# EAGLE design cpx-module1-B (EAGLE 8.7.0)
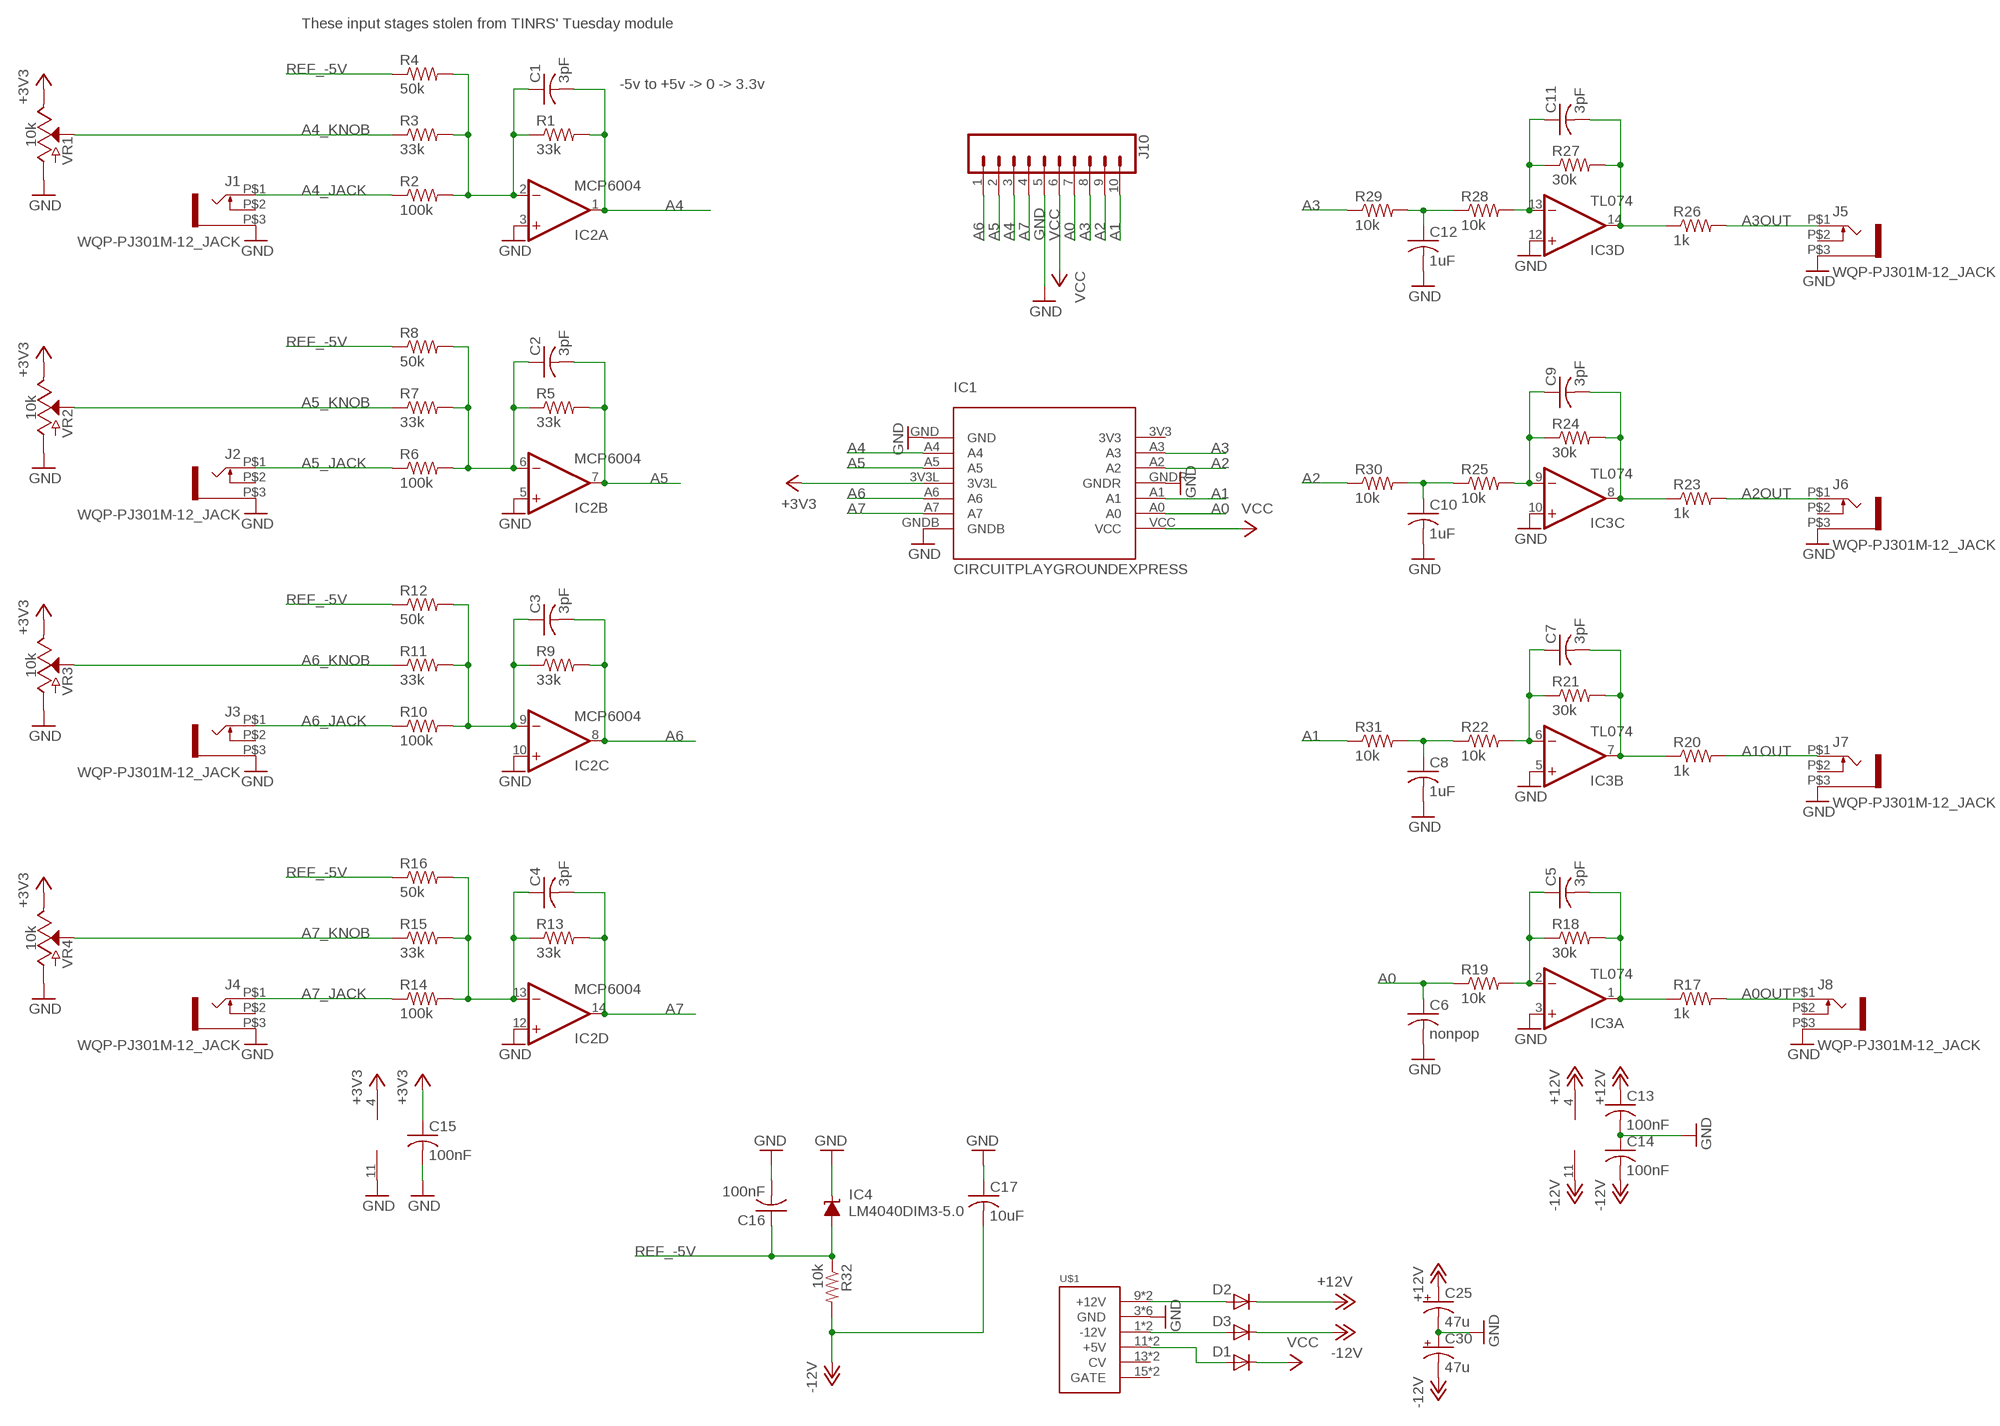
[diagram p0: schematic, sheet 1]

## Parts
C1  3pF  C-USC0603  [C0603]
C2  3pF  C-USC0603  [C0603]
C3  3pF  C-USC0603  [C0603]
C4  3pF  C-USC0603  [C0603]
C5  3pF  C-USC0603  [C0603]
C6  nonpop  C-USC0603  [C0603]
C7  3pF  C-USC0603  [C0603]
C8  1uF  C-USC0603  [C0603]
C9  3pF  C-USC0603  [C0603]
C10  1uF  C-USC0603  [C0603]
C11  3pF  C-USC0603  [C0603]
C12  1uF  C-USC0603  [C0603]
C13  100nF  C-USC0603  [C0603]
C14  100nF  C-USC0603  [C0603]
C15  100nF  C-USC0603  [C0603]
C16  100nF  C-USC0603  [C0603]
C17  10uF  C-USC0603  [C0603]
C25  47u  CPOL-USD  [PANASONIC_D]
C30  47u  CPOL-USD  [PANASONIC_D]
D1  1N5819HW  DIODE-SOD123  [SOD123]
D2  1N5819HW  DIODE-SOD123  [SOD123]
D3  1N5819HW  DIODE-SOD123  [SOD123]
IC1  CIRCUITPLAYGROUNDEXPRESS  [CIRCUITPLAYGROUNDEXPRESS]
IC2  MCP6004  TL074D  [SO14]
IC3  TL074  TL074D  [SO14]
IC4  LM4040DIM3-5.0  LM4041B12DBZ  [DBZ_R-PDSO-G3]
J1  WQP-PJ301M-12_JACK  [WQP-PJ301M-12_JACK]
J2  WQP-PJ301M-12_JACK  [WQP-PJ301M-12_JACK]
J3  WQP-PJ301M-12_JACK  [WQP-PJ301M-12_JACK]
J4  WQP-PJ301M-12_JACK  [WQP-PJ301M-12_JACK]
J5  WQP-PJ301M-12_JACK  [WQP-PJ301M-12_JACK]
J6  WQP-PJ301M-12_JACK  [WQP-PJ301M-12_JACK]
J7  WQP-PJ301M-12_JACK  [WQP-PJ301M-12_JACK]
J8  WQP-PJ301M-12_JACK  [WQP-PJ301M-12_JACK]
J10  CONN_10"  [1X10]
R1  33k  R-US_R0603  [R0603]
R2  100k  R-US_R0603  [R0603]
R3  33k  R-US_R0603  [R0603]
R4  50k  R-US_R0603  [R0603]
R5  33k  R-US_R0603  [R0603]
R6  100k  R-US_R0603  [R0603]
R7  33k  R-US_R0603  [R0603]
R8  50k  R-US_R0603  [R0603]
R9  33k  R-US_R0603  [R0603]
R10  100k  R-US_R0603  [R0603]
R11  33k  R-US_R0603  [R0603]
R12  50k  R-US_R0603  [R0603]
R13  33k  R-US_R0603  [R0603]
R14  100k  R-US_R0603  [R0603]
R15  33k  R-US_R0603  [R0603]
R16  50k  R-US_R0603  [R0603]
R17  1k  R-US_R0603  [R0603]
R18  30k  R-US_R0603  [R0603]
R19  10k  R-US_R0603  [R0603]
R20  1k  R-US_R0603  [R0603]
R21  30k  R-US_R0603  [R0603]
R22  10k  R-US_R0603  [R0603]
R23  1k  R-US_R0603  [R0603]
R24  30k  R-US_R0603  [R0603]
R25  10k  R-US_R0603  [R0603]
R26  1k  R-US_R0603  [R0603]
R27  30k  R-US_R0603  [R0603]
R28  10k  R-US_R0603  [R0603]
R29  10k  R-US_R0603  [R0603]
R30  10k  R-US_R0603  [R0603]
R31  10k  R-US_R0603  [R0603]
R32  10k  R-US_R0603  [R0603]
U$1  POWER  [POWER_16]
VR1  10k  POTENTIOMETER-PTH-9MM-1/20W-20%-KIT  [POT-PTH-ALPS-KIT]
VR2  10k  POTENTIOMETER-PTH-9MM-1/20W-20%-KIT  [POT-PTH-ALPS-KIT]
VR3  10k  POTENTIOMETER-PTH-9MM-1/20W-20%-KIT  [POT-PTH-ALPS-KIT]
VR4  10k  POTENTIOMETER-PTH-9MM-1/20W-20%-KIT  [POT-PTH-ALPS-KIT]

## Nets
+3V3: C15.1 IC1.3V3L IC2.4(P:V+) VR1.P$1(E) VR2.P$1(E) VR3.P$1(E) VR4.P$1(E)
+12V: C13.1 C25.+ D2.C IC3.4(P:V+)
-12V: C14.2 C17.2 C30.- D3.C IC3.11(P:V-) R32.2
A0: C6.1 IC1.A0 J10.7 R19.1
A0OUT: J8.P$1 R17.2
A1: IC1.A1 J10.10 R31.1
A1OUT: J7.P$1 R20.2
A2: IC1.A2 J10.9 R30.1
A2OUT: J6.P$1 R23.2
A3: IC1.A3 J10.8 R29.1
A3OUT: J5.P$1 R26.2
A4: C1.2 IC1.A4 IC2.1(A:OUT) J10.3 R1.2
A4_JACK: J1.P$1 R2.1
A4_KNOB: R3.1 VR1.P$2(S)
A5: C2.2 IC1.A5 IC2.7(B:OUT) J10.2 R5.2
A5_JACK: J2.P$1 R6.1
A5_KNOB: R7.1 VR2.P$2(S)
A6: C3.2 IC1.A6 IC2.8(C:OUT) J10.1 R9.2
A6_JACK: J3.P$1 R10.1
A6_KNOB: R11.1 VR3.P$2(S)
A7: C4.2 IC1.A7 IC2.14(D:OUT) J10.4 R13.2
A7_JACK: J4.P$1 R14.1
A7_KNOB: R15.1 VR4.P$2(S)
GND: C6.2 C8.2 C10.2 C12.2 C13.2 C14.1 C15.2 C16.2 C17.1 C25.- C30.+ IC1.GND IC1.GNDB IC1.GNDR IC2.3(A:+IN) IC2.5(B:+IN) IC2.10(C:+IN) IC2.11(P:V-) IC2.12(D:+IN) IC3.3(A:+IN) IC3.5(B:+IN) IC3.10(C:+IN) IC3.12(D:+IN) IC4.1(C) J1.P$3 J2.P$3 J3.P$3 J4.P$3 J5.P$3 J6.P$3 J7.P$3 J8.P$3 J10.5 U$1.3(GND) U$1.4(GND) U$1.5(GND) U$1.6(GND) U$1.7(GND) U$1.8(GND) VR1.P$3(A) VR2.P$3(A) VR3.P$3(A) VR4.P$3(A)
N$1: C5.2 IC3.1(A:OUT) R17.1 R18.2
N$2: C2.1 IC2.6(B:-IN) R5.1 R6.2 R7.2 R8.2
N$3: C3.1 IC2.9(C:-IN) R9.1 R10.2 R11.2 R12.2
N$4: C4.1 IC2.13(D:-IN) R13.1 R14.2 R15.2 R16.2
N$5: C1.1 IC2.2(A:-IN) R1.1 R2.2 R3.2 R4.2
N$7: C5.1 IC3.2(A:-IN) R18.1 R19.2
N$8: C7.2 IC3.7(B:OUT) R20.1 R21.2
N$9: C7.1 IC3.6(B:-IN) R21.1 R22.2
N$10: C9.2 IC3.8(C:OUT) R23.1 R24.2
N$12: C9.1 IC3.9(C:-IN) R24.1 R25.2
N$14: C11.2 IC3.14(D:OUT) R26.1 R27.2
N$15: C11.1 IC3.13(D:-IN) R27.1 R28.2
N$17: D2.A U$1.9(+12V) U$1.10(+12V)
N$18: D3.A U$1.1(-12V) U$1.2(-12V)
N$19: D1.A U$1.11(+5V) U$1.12(+5V)
N$20: C12.1 R28.1 R29.2
N$21: C10.1 R25.1 R30.2
N$22: C8.1 R22.1 R31.2
REF_-5V: C16.1 IC4.2(A) R4.1 R8.1 R12.1 R16.1 R32.1
VCC: D1.C IC1.VCC J10.6
Unconnected: IC1.3V3 J1.P$2 J2.P$2 J3.P$2 J4.P$2 J5.P$2 J6.P$2 J7.P$2 J8.P$2 U$1.13(CV) U$1.14(CV) U$1.15(GATE) U$1.16(GATE)

## Notes on the sheet
- These input stages stolen from TINRS' Tuesday module
- -5v to +5v -> 0 -> 3.3v

## Library data of the parts
C1-C17 = rcl:C-US: CAPACITOR, American symbol; SPICEPREFIX: C
C25 C30 = rcl:CPOL-US: POLARIZED CAPACITOR, American symbol
D1-D3 = diode:DIODE-: DIODE
IC1 = todstuff:CIRCUITPLAYGROUNDEXPRESS
IC2 IC3 = gm-ics:TL074: OP AMP
IC4 = texas:LM4041: PRECISION MICROPOWER SHUNT VOLTAGE REFERENCE Source: http://focus.ti.com/lit/ds/slcs146e/slcs146e.pdf; MPN: LM4041B12IDBZR; OC_FARNELL: 1575212; OC_NEWARK: 58K5882
J1-J8 = thonkiconn:WQP-PJ301M-12_JACK
J10 = SparkFun-Connectors:CONN_10: Multi connection point. Often used as Generic Header-pin footprint for 0.1 inch spaced/style header connections On any of the 0.1 inch spaced packages, you can populate with these: Break Away Headers - Straight <https://www.sparkfun.com/products/116> (PRT-00116) Break Away Male Headers - Right Angle <https://www.sparkfun.com/products/553> (PRT-00553) Female Headers <https://www.sparkfun.com/products/115> (PRT-00115) Break Away Headers - Machine Pin <https://www.sparkfun.com/products/117> (PRT-00117) Break Away Female Headers - Swiss Machine Pin <https://www.sparkfun.com/products/743> (PRT-00743) Arduino Stackable Header - 10 Pin <https://www.sparkfun.com/products/11376> (PRT-11376) For SCREWTERMINALS and SPRING TERMINALS visit here: Screw Terimnals on SparkFun.com <https://www.sparkfun.com/search/results?term=Screw+Terminals> (5mm/3.5mm/2.54mm spacing) This device is also useful as a general connection point to wire up your design to another part of your project. Our various solder wires solder well into these plated through hole pads. Hook-Up Wire - Assortment (Stranded, 22 AWG) <https://www.sparkfun.com/products/11375> (PRT-11375) Hook-Up Wire - Assortment (Solid Core, 22 AWG) <https://www.sparkfun.com/products/11367> (PRT-11367) View the entire wire category on our website here <https://www.sparkfun.com/categories/141> Special notes: Molex polarized connector foot print use with SKU : PRT-08231 with associated crimp pins and housings. 1MM SMD Version SKU: PRT-10208 NOTES ON THE VARIANTS LOCK and LOCK_LONGPADS... This footprint was designed to help hold the alignment of a through-hole component (i.e. 6-pin header) while soldering it into place. You may notice that each hole has been shifted either up or down by 0.005 of an inch from it's more standard position (which is a perfectly straight line). This slight alteration caused the pins (the squares in the middle) to touch the edges of the holes. Because they are alternating, it causes a "brace" to hold the component in place. 0.005 has proven to be the perfect amount of "off-center" position when using our standard breakaway headers. Although looks a little odd when you look at the bare footprint, once you have a header in there, the alteration is very hard to notice. Also,if you push a header all the way into place, it is covered up entirely on the bottom side.; PROD_ID: CONN-11563
R1-R32 = adafruit:R-US_: RESISTOR, American symbol
U$1 = eurorack:POWER
VR1-VR4 = SparkFun-Resistors:POTENTIOMETER: Potentiometer (Pot) Three-terminal potentiometers, with an adjustable wiper and two adjustable resistors. A pot can be used to create a configurable voltage divider, or as a variable resistor. Variants ALPS_POT and ALPS_POT_KIT - PTH, breadboard compatible, 9mm square pots Rotary Potentiometer - Linear (10k ohm) <https://www.sparkfun.com/products/9288> (COM-09288) The KIT variant exposes copper on only one side of the PTH pad, so the part can only be assembled on one side of the PCB. Useful for beginner soldering kits.; PROD_ID: RES-09177; SF_SKU: COM-09288

## Net classes
1 heavypower: width 0.381 mm
2 mediumpower: width 0.254 mm
3 groundplane: width 0.254 mm, clearance 0.203 mm

## Board
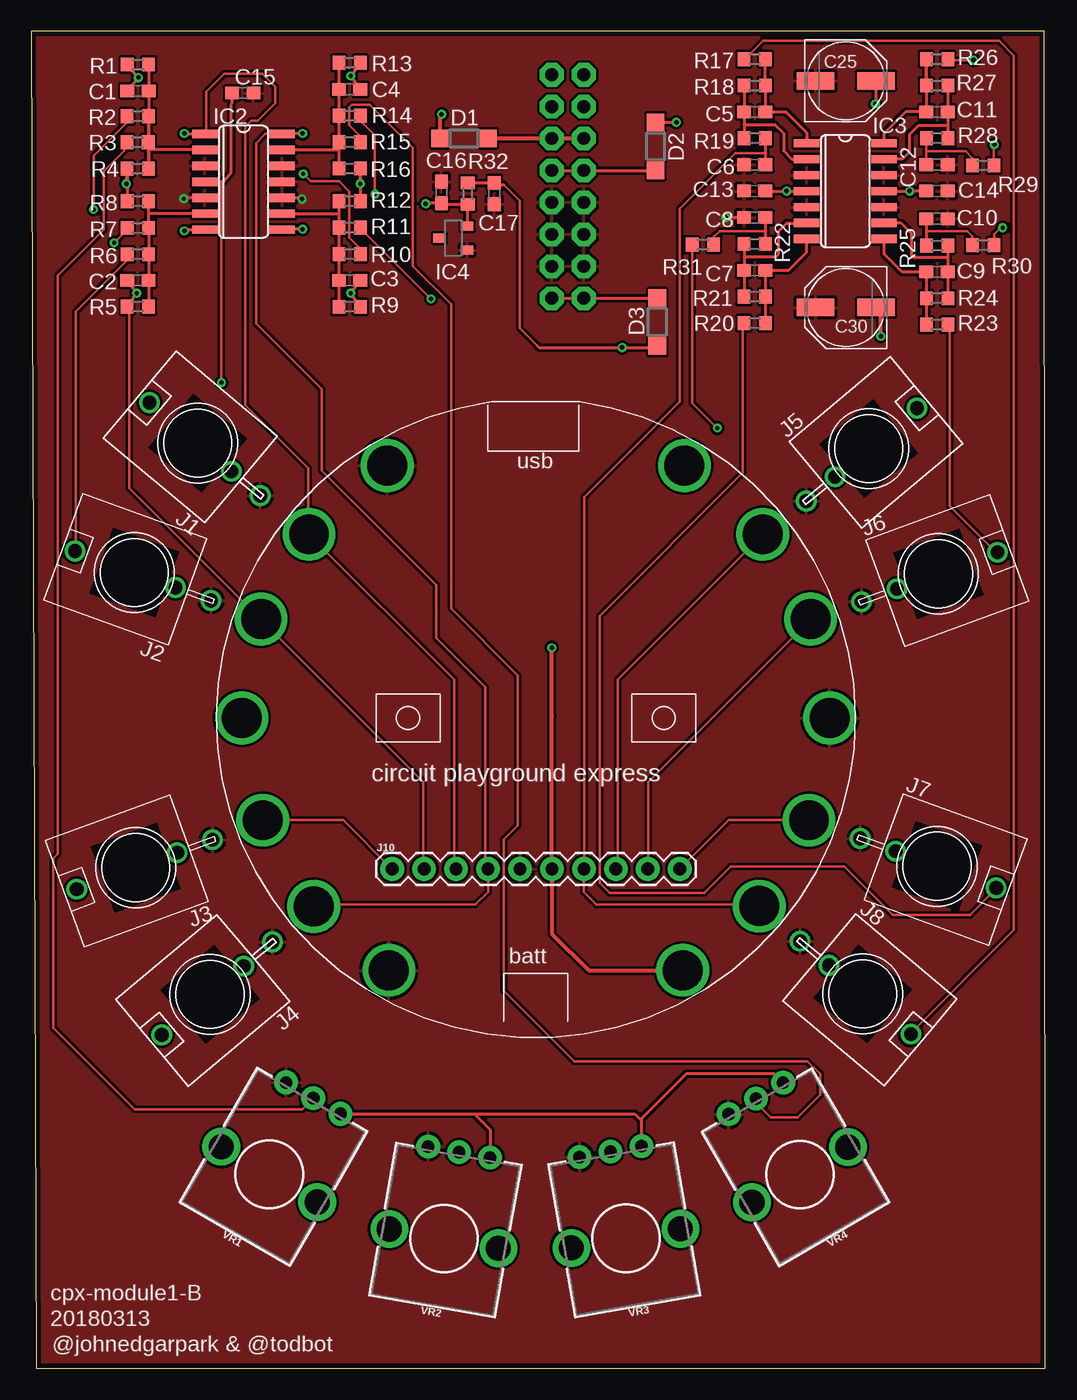
[diagram p1: board, top side]
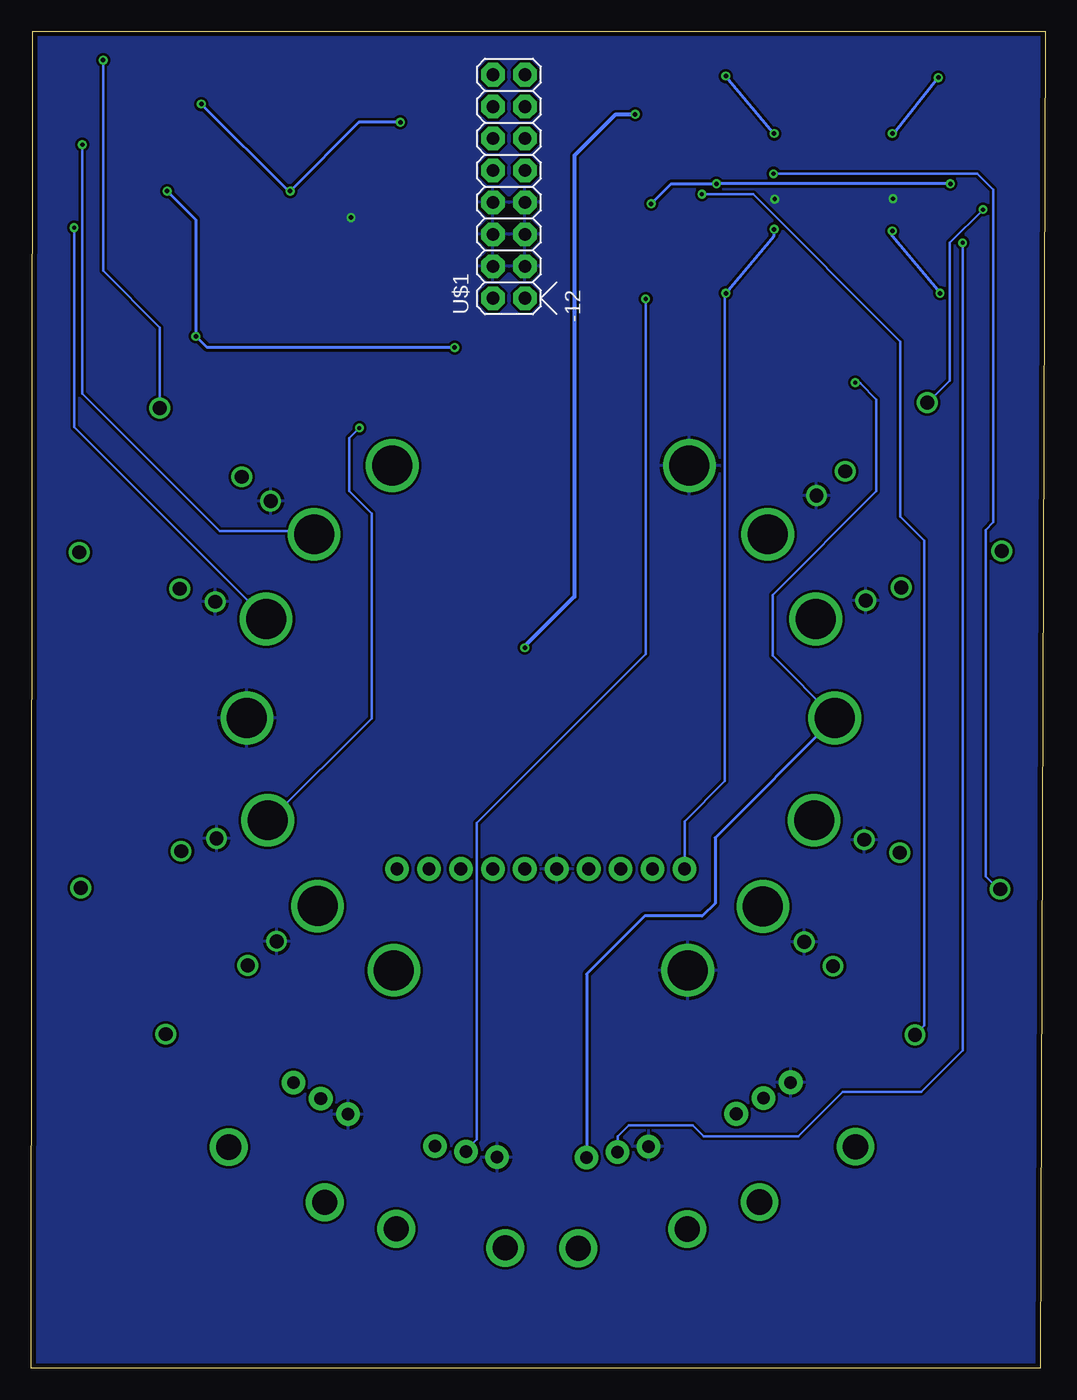
[diagram p2: board, bottom side, seen from below]

Size 80.6 x 106.3 mm. Coordinates in mm from the lower left corner, seen from the top.
Outline: 0.4,0 80.6,0 80.5,106.3 0,106.3 0.4,0
Copper layers (1*16): Top 0.0356mm / dielectric 1.5011mm / Bottom 0.0356mm
Design rules "LaenPCBOrderTodTent8mil": minimum track width 8mil, minimum drill 13mil, track to track 8mil, track to pad 8mil, pad to pad 8mil, via to via 8mil, smd to smd 8mil, copper to edge 15mil, drill to drill 8mil, minimum pad ring 7mil, minimum via ring 7mil, stop-mask expansion 3mil, vias tented up to drill 20mil, thermal gap 10mil

### Footprints (pad centres in the part's own frame; a part is rotated, then mirrored left to right if it is on the bottom)
C0603 = smd 1.1 x 1: 1 -0.85,0; 2 0.85,0
PANASONIC_D = smd 3 x 1.4: + 2.4,0; - -2.4,0
SOD123 = smd 1.4 x 1.4: A 1.9,0; C -1.9,0
CIRCUITPLAYGROUNDEXPRESS = drill 3.175: 3V3 11.811,20.066; 3V3L -23.368,0; A0 17.755,-14.961; A1 21.717,-8.128; A2 21.844,7.874; A3 18.034,14.605; A4 -18.034,14.605; A5 -21.844,7.874; A6 -21.717,-8.128; A7 -17.653,-14.986; GND -11.811,20.066; GNDB -11.684,-20.066; GNDR 23.368,0; VCC 11.684,-20.066
SO14 = smd 0.66 x 2.032: 1 -3.81,-3.073; 2 -2.54,-3.073; 3 -1.27,-3.073; 4 0,-3.073; 5 1.27,-3.073; 6 2.54,-3.073; 7 3.81,-3.073; 8 3.81,3.073; 9 2.54,3.073; 10 1.27,3.073; 11 0,3.073; 12 -1.27,3.073; 13 -2.54,3.073; 14 -3.81,3.073
DBZ_R-PDSO-G3 = smd 0.7 x 1: 1 -0.95,-1.1; 2 0.95,-1.1; 3 0,1.1
WQP-PJ301M-12_JACK = drill 1.1: P$1 0,5; P$2 0,-3.5; P$3 0,-6.5
1X10 = drill 1.016 pad 1.88: 1 0,0; 2 2.54,0; 3 5.08,0; 4 7.62,0; 5 10.16,0; 6 12.7,0; 7 15.24,0; 8 17.78,0; 9 20.32,0; 10 22.86,0
R0603 = smd 1 x 1.1: 1 -0.85,0; 2 0.85,0
POWER_16 = drill 1.016 pad 1.88 octagon: 1 -6.35,-1.27; 2 -6.35,1.27; 3 -3.81,-1.27; 4 -3.81,1.27; 5 -1.27,-1.27; 6 -1.27,1.27; 7 1.27,-1.27; 8 1.27,1.27; 9 3.81,-1.27; 10 3.81,1.27; 11 6.35,-1.27; 12 6.35,1.27; 13 8.89,-1.27; 14 8.89,1.27; 15 11.43,-1.27; 16 11.43,1.27
POT-PTH-ALPS-KIT = drill 1 pad 1.88: P$1 7,-2.5; P$2 7,0; P$3 7,2.5 | drill 2: P$4 0,-4.4; P$5 0,4.4

### Placement (x,y rotation side)
C1  8.46,101.57 180 top
C2  8.46,86.51 180 top
C3  25.3,86.5 0 top
C4  25.3,101.7 0 top
C5  57.5,99.9 0 top
C6  57.5,95.7 180 top
C7  57.5,87.3 0 top
C8  57.5,91.5 180 top
C9  72,87.17 180 top
C10  72,91.4 0 top
C11  72,99.9 180 top
C12  72,95.7 0 top
C13  57.5,93.6 180 top
C14  72,93.6 180 top
C15  16.8,101.4 0 top
C16  32.59,93.5 90 top
C17  36.8,93.4 90 top
C25  64.74,102.37 0 top
C30  64.74,84.34 180 top
D1  34.39,97.8 0 top
D2  49.62,97.17 270 top
D3  49.75,83.2 90 top
IC1  40.1,51.7 0 top
IC2  16.86,94.34 270 top
IC3  64.7,93.6 270 top
IC4  33.54,89.85 90 top
J1  13.21,73.57 50 top
J2  8.17,63.27 70 top
J3  8.29,39.79 110 top
J4  14.19,29.72 130 top
J5  66.57,73.12 310 top
J6  72.1,63.17 290 top
J7  71.99,39.9 250 top
J8  66.09,29.77 230 top
J10  28.68,39.69 0 top
R1  8.46,103.67 180 top
R2  8.46,99.55 0 top
R3  8.44,97.48 0 top
R4  8.46,95.38 0 top
R5  8.46,84.42 180 top
R6  8.46,88.57 0 top
R7  8.46,90.67 0 top
R8  8.46,92.8 0 top
R9  25.3,84.4 0 top
R10  25.3,88.6 180 top
R11  25.3,90.7 180 top
R12  25.3,92.8 180 top
R13  25.3,103.8 0 top
R14  25.3,99.6 180 top
R15  25.3,97.5 180 top
R16  25.3,95.4 180 top
R17  57.5,104.1 180 top
R18  57.5,102 0 top
R19  57.5,97.8 180 top
R20  57.5,83.1 180 top
R21  57.5,85.2 0 top
R22  57.5,89.4 180 top
R23  72,82.97 0 top
R24  72,85.07 180 top
R25  72,89.27 0 top
R26  72,104.1 0 top
R27  72,102 180 top
R28  72,97.8 0 top
R29  75.66,95.64 180 top
R30  75.66,89.29 180 top
R31  53.38,89.35 0 top
R32  34.7,93.4 90 top
U$1  42.64,91.43 90 bottom
VR1  18.9,15.4 60 top
VR2  32.79,10.29 80 top
VR3  47.26,10.32 100 top
VR4  61.1,15.38 120 top

### Tracks (layer width: path | path; a pad name or v marks a point on that pad's centre or on a via)
+3V3  (via drill 0.33)
  Top 0.203: 36.65,16.75 VR2.P$1 36.44,16.75 | 48.43,17.77 VR3.P$1 48.63,17.77 | v15.11,78.37 15.11,94.34 15.11,94.37
  Top 0.254: IC2.4 15.11,94.34 15.25,94.34 15.33,94.42 15.88,95.1 15.88,100.46 15.95,100.65 C15.1 | VR4.P$1 59.07,23.38 52.04,23.38 48.48,19.82 48.48,19.7 | 48.48,19.7 48.48,17.82 48.43,17.77 | VR2.P$1 36.49,18.93 35.21,20.22 | VR1.P$1 35.21,20.22 | 35.21,20.22 47.96,20.22 48.48,19.7
  Bottom 0.203: v15.11,78.37 14.73,78.32 13.43,77.02 13.43,69.73 21.69,61.48 21.69,56.65 IC1.3V3L
  Bottom 0.254: IC1.3V3L 26.26,42.18 26.26,36.97 27.27,35.95 31.84,35.95 36.47,31.33 VR2.P$1
+12V  (via drill 0.35)
  Top 0.254: C25.+ 67.14,100.58 v67.09,100.53 | C13.1 v60.04,93.6 IC3.4 | D2.C v51.27,99.07 v51.28,99.07
  Bottom 0.254: v67.09,100.53 60.16,93.6 v60.04,93.6 54.57,99.07 v51.28,99.07
-12V  (via drill 0.35)
  Top 0.203: 40.22,81.3 38.83,82.69 38.83,92.83 37.56,94.1
  Top 0.254: R32.2 C17.2 36.95,94.1 37.56,94.1 | IC3.11 v69.82,93.6 C14.2 | 40.22,81.3 40.35,81.16 v46.96,81.16 49.62,81.16 D3.C
  Top 0.305: v67.53,82.05 67.53,84.34 | 67.66,84.47 67.53,84.34 | 67.53,84.34 C30.-
  Bottom 0.254: v46.96,81.16 66.64,81.16 v67.53,82.05 67.53,91.31 v69.82,93.6
A0
  Top 0.203: 58.39,96.61 58.35,96.61 55.95,96.61 51.53,92.19 51.53,76.85 47.62,72.93 47.62,72.91 43.96,69.25 43.96,39.71 J10.7 | IC1.A0 57.78,36.87 44.95,36.87 44.93,36.84 43.92,37.85 J10.7 | 43.96,39.51 J10.7
  Top 0.254: R19.1 58.35,96.61 C6.1
A0OUT
  Top 0.203: R17.2 56.76,104.13 58.19,105.55 76.93,105.55 78.1,104.38 78.1,34.83 69.97,26.71 J8.P$1
A1  (via drill 0.33)
  Top 0.203: v54.53,74.76 52.53,76.76 R31.1 | IC1.A1 55.42,43.57 J10.10
  Bottom 0.203: IC1.A1 61.64,43.57 53.56,51.65 53.56,67.96 55.34,69.73 55.34,73.95 v54.53,74.76 | 51.68,39.71 J10.10
A1OUT
  Top 0.203: R20.2 56.56,82.99 56.56,71.21 45.18,59.83 45.18,38.59 45.99,37.78 53.49,37.78 55.59,39.89 64.64,39.89 68.47,36.05 74.64,36.05 76.68,38.09 J7.P$1
A2  (via drill 0.33)
  Top 0.203: J10.9 49.04,39.71 49.04,46.62 61.84,59.42 IC1.A2 | R30.1 76.55,89.33 76.55,90.18 77.06,90.69 v77.21,90.69
  Bottom 0.203: 62.05,59.62 IC1.A2 77.21,74.84 v77.21,90.69
A2OUT
  Top 0.203: R23.2 73.02,82.79 73.02,68.57 76.68,64.91 J6.P$1
A3  (via drill 0.35)
  Top 0.203: 58.19,66.33 IC1.A3 57.98,66.13 46.6,54.75 46.6,39.71 J10.8 | R29.1 76.51,97.25 v76.55,97.29
  Bottom 0.203: v76.55,97.29 76.55,77.48 65.63,66.56 58.39,66.56 IC1.A3
A3OUT  (via drill 0.35)
  Top 0.203: 73.02,103.92 R26.2 72.93,104.02 v74.9,104.02 | 70.58,76.49 J5.P$1
  Bottom 0.203: v74.9,104.02 74.9,87.26 70.4,82.76 J5.P$1
A4  (via drill 0.35)
  Top 0.203: J10.3 33.6,39.71 33.6,54.75 22.22,66.13 IC1.A4 22.02,66.33 22.02,71.56 17.01,76.57 17.01,98.72 17.49,99.2 18,99.2 19.4,100.59 19.4,101.89 18.36,102.93 15.31,102.93 13.89,101.51 13.89,98.23 IC2.1
  Top 0.254: R1.2 v8.5,102.63 C1.2 | v12.16,98.18 12.19,98.15 IC2.1
  Bottom 0.254: v8.5,102.63 12.06,98.18 v12.16,98.18
A4_JACK  (via drill 0.33)
  Top 0.203: v4.95,92.14 4.95,96.4 7.59,99.05 7.59,99.45 R2.1
  Bottom 0.203: v4.95,92.14 7.59,89.5 7.59,78.52 9.21,76.9 J1.P$1
A4_KNOB
  Top 0.203: R3.1 7.38,97.42 7.38,96.81 5.76,95.19 5.76,90.54 2.1,86.88 2.1,40.88 1.75,40.52 1.75,27.06 8.22,20.59 21.52,20.59 VR1.P$2 22.22,21.63
  Top 0.254: R3.1 7.51,97.4
A5  (via drill 0.35)
  Top 0.203: J10.2 31.16,39.71 31.16,46.62 18.36,59.42 IC1.A5 18.15,59.62 7.79,69.99 7.79,84.42 R5.2
  Top 0.254: C2.2 v8.37,85.48 R5.2 | v12.16,90.44 12.26,90.53 IC2.7
  Bottom 0.254: v8.37,85.48 12.16,90.04 v12.16,90.44
A5_JACK
  Top 0.203: R6.1 7.59,88.48 7.59,88.07 3.52,84.01 3.52,65.11 J2.P$1
A5_KNOB  (via drill 0.33)
  Top 0.203: v6.57,89.5 7.59,90.51 R7.1
  Bottom 0.203: 34,17.36 VR2.P$2 34,18.43 33.12,19.32 28.04,19.32 27.15,18.43 19.65,18.43 16.1,21.98 9.87,21.98 6.57,25.28 v6.57,89.5
A6  (via drill 0.35)
  Top 0.203: 28.52,39.71 28.66,39.69 | 28.66,39.69 J10.1 | 18.56,43.57 IC1.A6 24.78,43.57 28.66,39.69
  Top 0.254: C3.2 v25.39,85.48 R9.2 | v21.56,90.56 19.96,90.56 IC2.8
  Bottom 0.203: v25.39,85.48 25.47,85.43 25.47,46.7 28.68,43.49 J10.1 28.52,39.71
  Bottom 0.254: v25.39,85.48 21.56,90.07 v21.56,90.56
A6_JACK  (via drill 0.33)
  Top 0.203: v21.61,94.98 22.22,94.37 24.45,94.37 25.27,93.56 25.27,89.9 26.08,89.09 26.08,88.68 R10.1
  Bottom 0.203: J3.P$1 3.73,38.09 4.74,39.1 4.74,66.66 4.13,67.27 4.13,93.71 5.4,94.98 v21.61,94.98
A6_KNOB  (via drill 0.33)
  Top 0.203: v31.77,85.03 26.28,90.51 R11.1
  Top 0.254: R11.1 26.25,90.6
  Bottom 0.203: v31.77,85.03 31.77,56.78 45.18,43.37 45.18,18.17 45.99,17.36 VR3.P$2
A7  (via drill 0.35)
  Top 0.203: IC1.A7 22.62,36.87 35.3,36.87 36.3,37.87 36.3,39.51 | 19.17,98.03 19.78,98.03 IC2.14 18.61,98.15 17.88,97.42 17.88,83.07 23.08,77.86 23.08,71.39 32.18,62.29 32.18,58.05 36.06,54.16 36.06,39.75 36.3,39.51 | 36.3,39.51 J10.4
  Top 0.254: R13.2 v25.39,102.75 C4.2 | v21.56,98.18 20.03,98.18 IC2.14
  Bottom 0.254: v25.39,102.75 21.45,98.06 v21.56,98.18
A7_JACK  (via drill 0.33)
  Top 0.203: v27.3,93.36 27.3,98.03 26.28,99.05 26.28,99.45 R14.1
  Bottom 0.203: v27.3,93.36 23.23,93.36 11.53,81.65 11.53,67.7 9.62,65.8 9.62,27.24 J4.P$1 10.43,26.5
A7_KNOB
  Top 0.203: R15.1 26.08,97.62 26.08,98.03 25.27,98.84 25.27,100.27 25.47,100.47 26.89,100.47 30.32,97.04 30.32,87.64 33.37,84.59 33.37,60.39 38.68,55.08 38.68,43.14 37.56,42.02 37.56,29.98 43.15,24.4 61.69,24.4 62.71,23.38 62.71,21.73 60.93,19.95 58.77,19.95 57.6,21.12 VR4.P$2
GND  (via drill 0.35)
  Top 0.254: IC2.5 12.62,93.07 v12.11,93 | IC2.10 21.64,93.07 v21.51,92.97 | C8.2 v55.2,91.5
  pour Top: -0.2,108.3 81.5,108.3 81.5,-1.3 -0.4,-1.3 -0.3,108
  pour Bottom: -0.9,107.7 82.1,107.7 82.1,-1.3 0.1,-1.3
N$1
  Top 0.254: IC3.1 61.63,98.25 59.97,99.9 C5.2 R18.2 R17.1
N$2
  Top 0.254: R8.2 9.29,91.7 | 9.29,91.7 9.27,90.72 R7.2 R6.2 9.32,86.52 C2.1 R5.1 | IC2.6 9.39,91.8 9.29,91.7
N$3
  Top 0.203: R9.1 24.45,84.42
  Top 0.254: R12.2 24.45,91.8 | 24.45,91.8 R11.2 R10.2 C3.1 24.45,84.42 | IC2.9 24.45,91.8
N$4
  Top 0.254: R13.1 C4.1 R14.2 R15.2 24.45,96.8 | 24.45,96.8 R16.2 | IC2.13 24.37,96.88 24.45,96.8
N$5
  Top 0.254: R1.1 C1.1 9.32,97.4 | 9.32,97.4 R4.2 9.29,95.4 9.29,96.8 | R2.2 9.3,97.41 9.32,97.4 | R3.2 9.29,96.8 | IC2.2 9.37,96.88 9.29,96.8
N$7
  Top 0.254: R18.1 C5.1 56.65,98.9 | 56.65,98.9 R19.2 | 56.65,98.9 59.1,98.9 59.8,98.2 59.8,96.8 60.46,96.14 IC3.2
N$8
  Top 0.254: IC3.7 61.63,88.73 60.2,87.3 C7.2 R21.2 R20.1
N$9
  Top 0.254: R22.2 56.65,88.4 | 56.65,88.4 C7.1 R21.1 | IC3.6 60.06,91.06 59.4,90.4 59.4,88.6 59.2,88.4 56.65,88.4
N$10
  Top 0.254: R23.1 R24.2 C9.2 69.23,87.17 67.8,88.6 67.8,89.76 IC3.8
N$12
  Top 0.254: R25.2 72.85,88.2 | 72.85,88.2 C9.1 R24.1 | IC3.9 69.14,91.06 70,90.2 70,88.5 70.2,88.3 72.75,88.3 72.85,88.2
N$14
  Top 0.254: R27.2 R26.1 C11.2 69.5,99.9 67.77,98.17 IC3.14
N$15
  Top 0.254: R27.1 C11.1 72.85,98.8 | 72.85,98.8 R28.2 | 72.85,98.8 70.5,98.8 69.8,98.1 69.8,96.7 69.24,96.14 IC3.13
N$17
  Top 0.254: U$1.9 U$1.10 49.73,95.24 D2.A
N$18
  Top 0.254: U$1.2 U$1.1 40.75,85.08 D3.A
N$19
  Top 0.305: U$1.12 U$1.11 36.3,97.78 D1.A
N$20
  Top 0.203: R28.1 71.15,96.78 | 71.15,96.78 C12.1 | R29.2 74.81,96.24 74.26,96.78 71.15,96.78
N$21
  Top 0.203: R30.2 74.81,90.02 74.39,90.44 71.15,90.44
  Top 0.254: C10.1 71.15,90.44 R25.1
N$22
  Top 0.203: R31.2 54.23,89.96 54.7,90.44 58.35,90.44
  Top 0.254: C8.1 58.35,90.44 R22.1
REF_-5V  (via drill 0.35)
  Top 0.254: R16.1 26.15,95.2 | 26.15,95.2 R12.1 | R8.1 7.61,92.82 R4.1 7.6,95.38 v7.54,94.18 | v26.14,94.18 26.15,95.2 | IC4.2 34.65,92.51 R32.1 32.7,92.55 C16.1 31.39,92.65 v31.34,92.59
  Bottom 0.254: v7.54,94.18 v26.14,94.18 29.75,94.18 v31.34,92.59
VCC  (via drill 0.35)
  Top 0.203: 41.32,39.71 J10.6 | 32.54,99.64 v32.61,99.71
  Top 0.305: D1.C 32.48,99.58 32.54,99.64 | v41.37,57.29 41.38,51.82 J10.6 41.38,34.55 44.29,31.63 IC1.VCC
  Bottom 0.305: v32.61,99.71 34.13,99.71 37.43,96.4 37.43,61.35 41.37,57.42 v41.37,57.29

### Text on the board
tPlace: cpx-module1-B | 20180313 | @johnedgarpark & @todbot